# Altium schematic sheet GS_Connector.SchDoc
size Letter; SheetNumber: 1; SheetTotal: 3
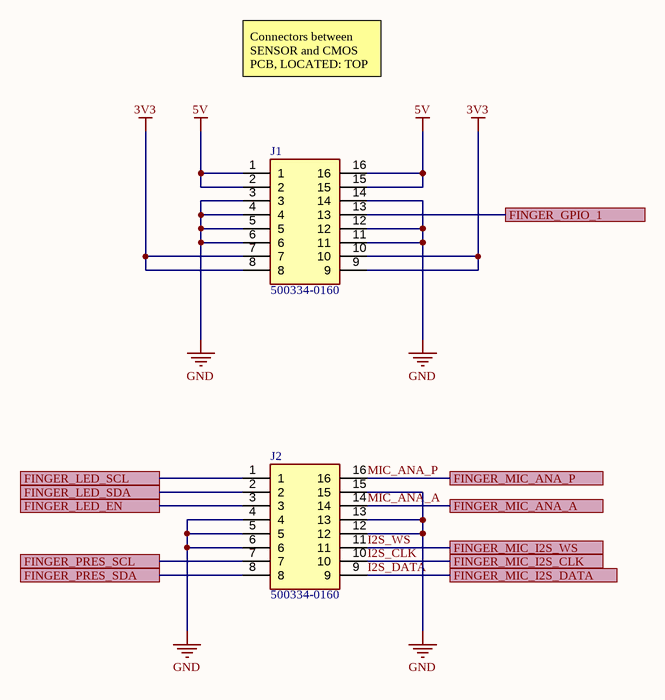
[diagram p0: GS_Connector.SchDoc]

## Parts
J1  500334-0160  [5003340160]
J2  500334-0160  [5003340160]

## Ports
FINGER_GPIO_1, FINGER_LED_EN, FINGER_LED_SCL, FINGER_LED_SDA, FINGER_MIC_ANA_A, FINGER_MIC_ANA_P, FINGER_MIC_I2S_CLK, FINGER_MIC_I2S_DATA, FINGER_MIC_I2S_WS, FINGER_PRES_SCL, FINGER_PRES_SDA

## Nets
3V3: J1.7 J1.8 J1.9 J1.10
5V: J1.1 J1.2 J1.15 J1.16
GND: J1.3 J1.4 J1.5 J1.6 J1.11 J1.12 J1.14 J2.4 J2.5 J2.6 J2.12 J2.13 J2.15
FINGER_GPIO_1: J1.13 ; port FINGER_GPIO_1
FINGER_LED_EN: J2.3 ; port FINGER_LED_EN
FINGER_LED_SCL: J2.1 ; port FINGER_LED_SCL
FINGER_LED_SDA: J2.2 ; port FINGER_LED_SDA
FINGER_PRES_SCL: J2.7 ; port FINGER_PRES_SCL
FINGER_PRES_SDA: J2.8 ; port FINGER_PRES_SDA
I2S_CLK: J2.10 ; port FINGER_MIC_I2S_CLK
I2S_DATA: J2.9 ; port FINGER_MIC_I2S_DATA
I2S_WS: J2.11 ; port FINGER_MIC_I2S_WS
MIC_ANA_A: J2.14 ; port FINGER_MIC_ANA_A
MIC_ANA_P: J2.16 ; port FINGER_MIC_ANA_P

## Notes on the sheet
- Connectors between SENSOR and CMOS PCB, LOCATED: TOP
- Title
- Copyright (c) Meta Platforms, Inc. and affiliates.
  All rights reserved.
  This source code is licensed under the license found in the
  LICENSE file in the root directory of this source tree.
- Sheet
- of

## Library data of the parts
J1 J2 = 500334-0160: Connector; Manufacturer_Name: Molex; Height: 1.68mm; Manufacturer_Part_Number: 500334-0160; Mouser Part Number: 538-500334-0160; Mouser Price/Stock: https://www.mouser.co.uk/ProductDetail/Molex/500334-0160?qs=ICeuwU4uWg1Cw%2F8VAmRoPA%3D%3D